# EAGLE schematic placaESP-PORTA_LAR (EAGLE 8.6.3)
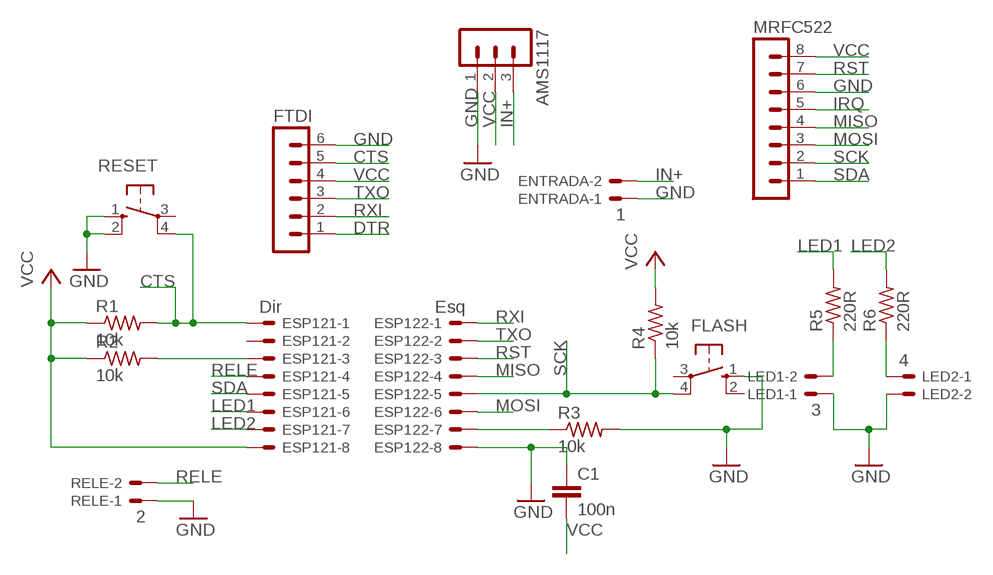
[diagram p0: schematic, sheet 1]

## Parts
AMS1117  MA03-1  [MA03-1]
C1  100n  C-EU025-025X050  [C025-025X050]
ENTRADA  1  22-23-2021  [22-23-2021]
ESP121  Dir  22-23-2081  [22-23-2081]
ESP122  Esq  22-23-2081  [22-23-2081]
FLASH  10-XX  [B3F-10XX]
FTDI  MA06-1  [MA06-1]
LED1  3  22-23-2021  [22-23-2021]
LED2  4  22-23-2021  [22-23-2021]
MRFC522  MA08-1  [MA08-1]
R1  10k  R-US_0207/10  [0207/10]
R2  10k  R-US_0207/10  [0207/10]
R3  10k  R-US_0207/10  [0207/10]
R4  10k  R-US_0207/10  [0207/10]
R5  220R  R-US_0207/10  [0207/10]
R6  220R  R-US_0207/10  [0207/10]
RELE  2  22-23-2021  [22-23-2021]
RESET  10-XX  [B3F-10XX]

## Nets
CTS: ESP121.1 FTDI.5 R1.2 RESET.4(P1)
DTR: FTDI.1
GND: AMS1117.1 C1.1 ENTRADA.1 ESP122.8 FLASH.1(S) FTDI.6 LED1.1 LED2.2 MRFC522.6 R3.2 RELE.1 RESET.1(S) RESET.2(S1)
IN+: AMS1117.3 ENTRADA.2
IRQ: MRFC522.5
LED1: ESP121.6 R5.2
LED2: ESP121.7 R6.2
MISO: ESP122.4 MRFC522.4
MOSI: ESP122.6 MRFC522.3
N$1: ESP122.7 R3.1
N$3: ESP121.3 R2.2
N$5: LED1.2 R5.1
N$6: LED2.1 R6.1
RELE: ESP121.4 RELE.2
RST: ESP122.3 MRFC522.7
RXI: ESP122.1 FTDI.2
SCK: ESP122.5 FLASH.4(P1) MRFC522.2 R4.1
SDA: ESP121.5 MRFC522.1
TXO: ESP122.2 FTDI.3
VCC: AMS1117.2 C1.2 ESP121.8 FTDI.4 MRFC522.8 R1.1 R2.1 R4.2
Unconnected: ESP121.2 FLASH.2(S1) FLASH.3(P) RESET.3(P)

## Library data of the parts
AMS1117 = con-lstb:MA03-1: PIN HEADER; OC_FARNELL: unknown; OC_NEWARK: unknown
C1 = rcl:C-EU: CAPACITOR, European symbol
ENTRADA LED1 LED2 RELE = con-molex:22-23-2021: .100" (2.54mm) Center Header - 2 Pin; MF: MOLEX; MPN: 22-23-2021; OC_FARNELL: 1462926; OC_NEWARK: 25C3832
ESP121 ESP122 = con-molex:22-23-2081: .100" (2.54mm) Center Header - 8 Pin; MF: MOLEX; MPN: 22-23-2081; OC_FARNELL: 1756826; OC_NEWARK: 01C7592
FLASH RESET = switch-omron:10-XX: OMRON SWITCH; MPN: B3F-1000; OC_FARNELL: 176432; OC_NEWARK: 36M3542
FTDI = con-lstb:MA06-1: PIN HEADER; OC_FARNELL: unknown; OC_NEWARK: unknown
MRFC522 = con-lstb:MA08-1: PIN HEADER; OC_FARNELL: unknown; OC_NEWARK: unknown
R1-R6 = resistor:R-US_: RESISTOR, American symbol